# Altium schematic sheet LCD_RGB.SchDoc
size A3
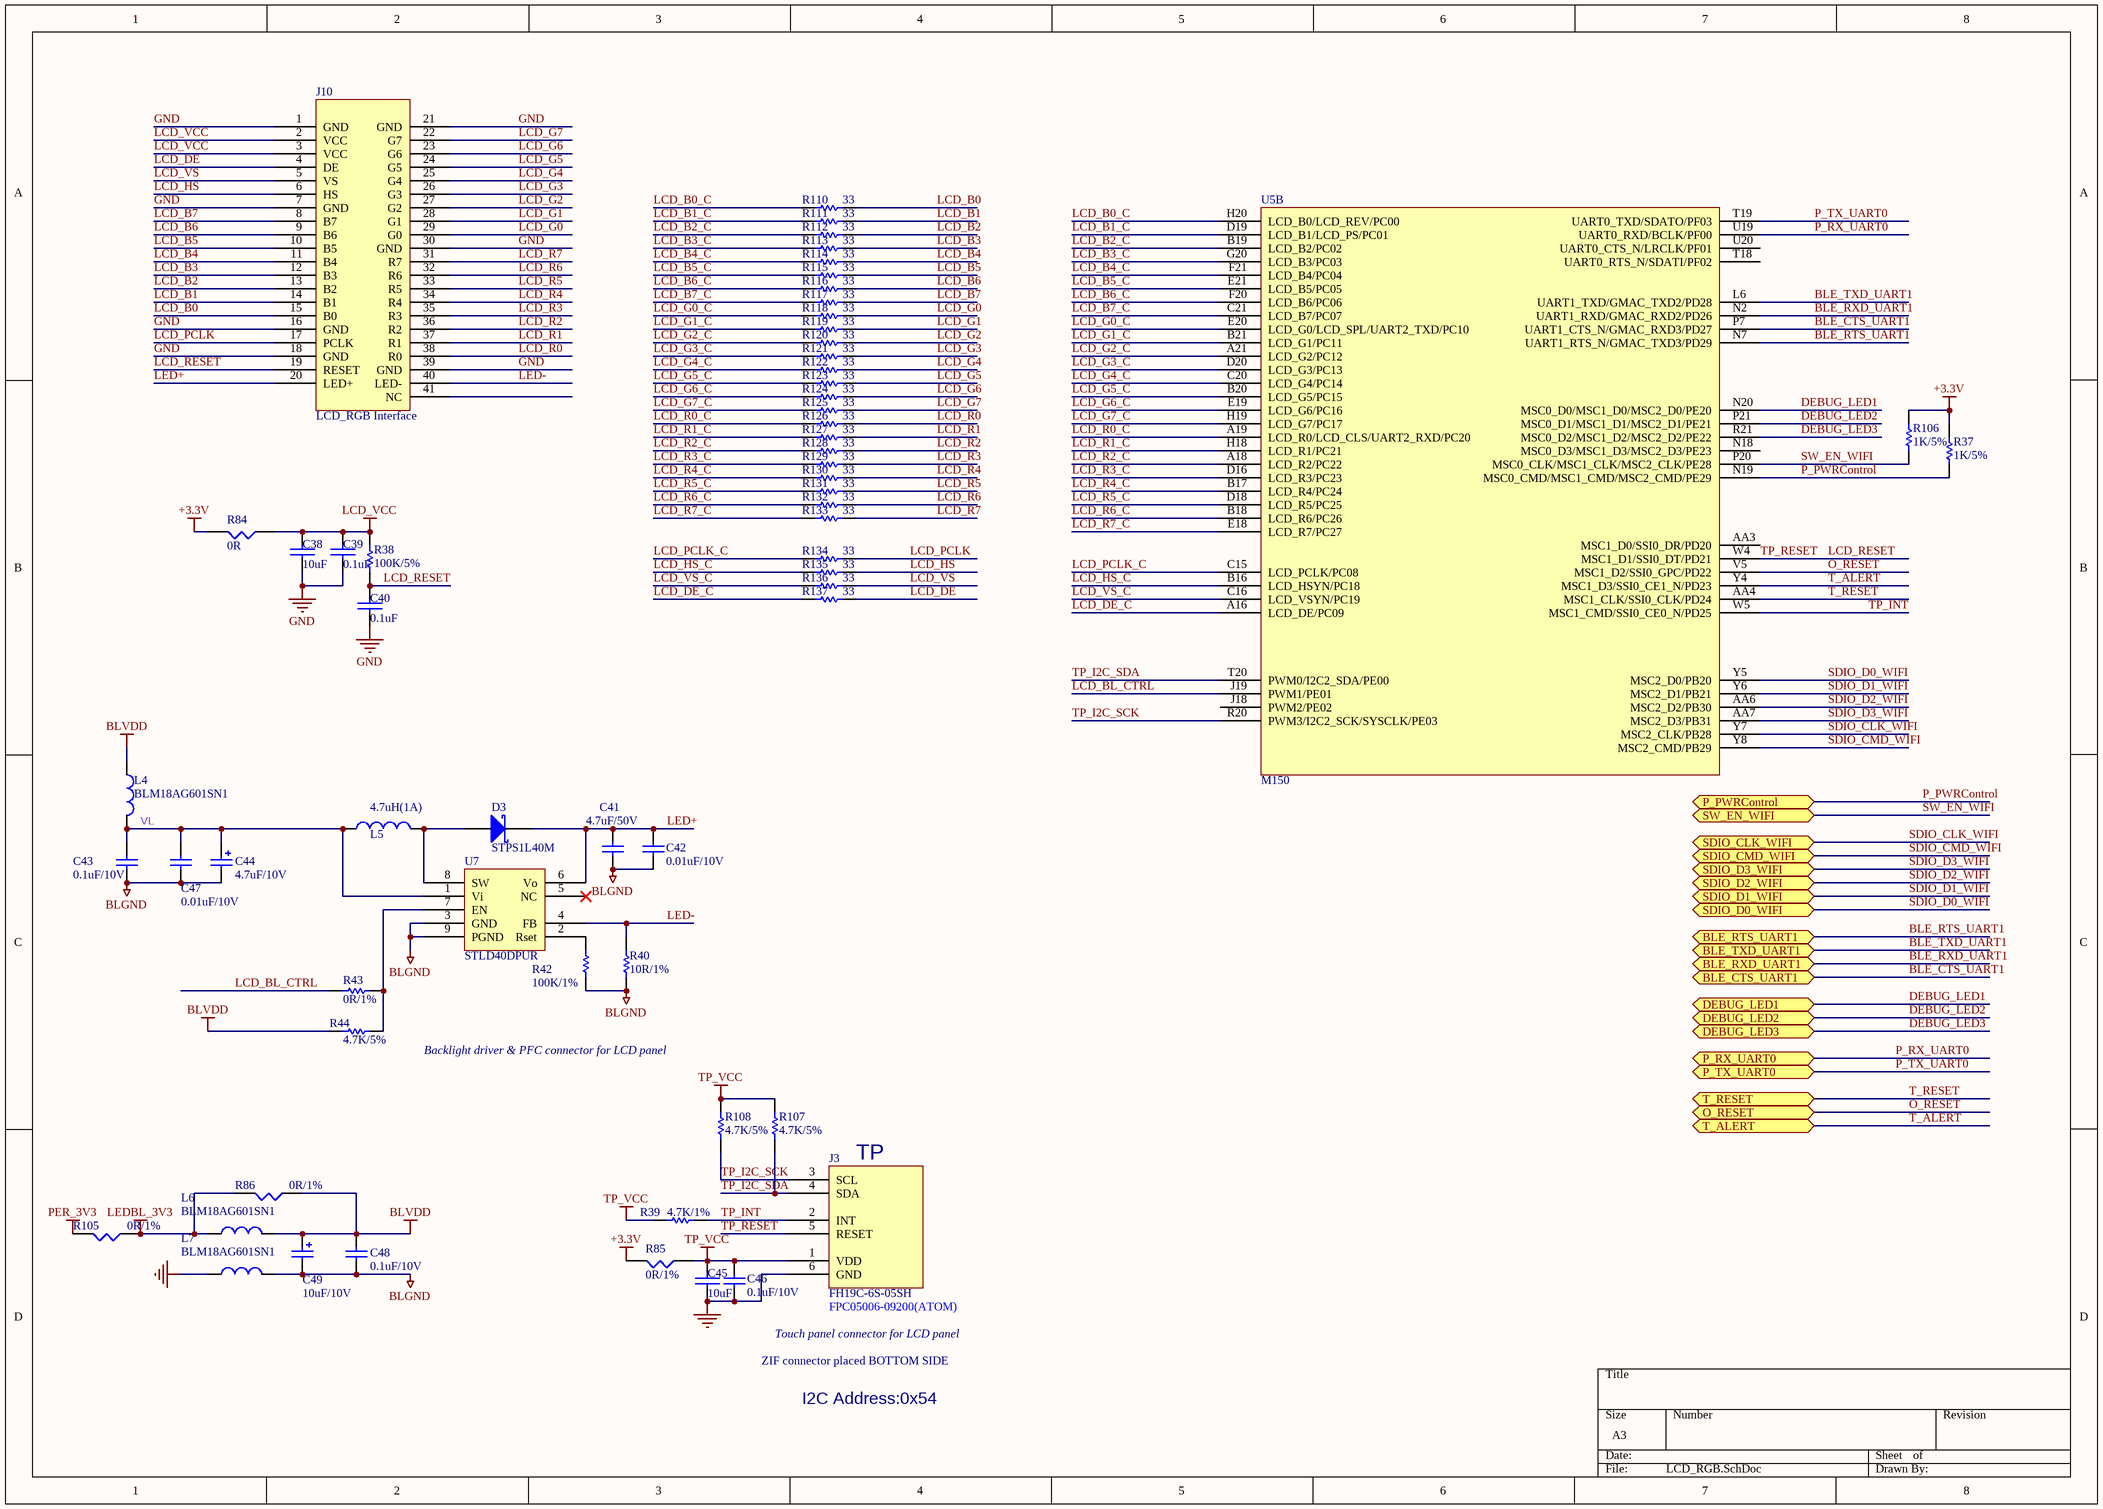
[diagram p0: LCD_RGB.SchDoc]

## Parts
C38  10uF  [0402C]
C39  0.1uF  [0402C]
C40  0.1uF  [0402C]
C41  4.7uF/50V  [0603C]
C42  0.01uF/10V  [0402C]
C43  0.1uF/10V  [0402C]
C44  4.7uF/10V  [1206]
C45  10uF  [0402C]
C46  0.1uF/10V  [0402C]
C47  0.01uF/10V  [0402C]
C48  0.1uF/10V  [0402C]
C49  10uF/10V  [TAN-A]
D3  STPS1L40M  [DO-216AA]
J3  FH19C-6S-05SH  [FH19C-6S-0R5SH_FPC_CPT]
J10  LCD_RGB Interface
L4  BLM18AG601SN1  [0603R]
L5  4.7uH(1A)  [1210L]
L6  BLM18AG601SN1  [0603R]
L7  BLM18AG601SN1  [0603R]
R37  1K/5%  [0402R]
R38  100K/5%  [0402R]
R39  4.7K/1%  [0402R]
R40  10R/1%  [0402R]
R42  100K/1%  [0402R]
R43  0R/1%  [0603R]
R44  4.7K/5%  [0402R]
R84  0R  [0603R]
R85  0R/1%  [0603R]
R86  0R/1%  [0603R]
R105  0R/1%  [0603R]
R106  1K/5%  [0402R]
R107  4.7K/5%  [0402R]
R108  4.7K/5%  [0402R]
R110  33  [0402R]
R111  33  [0402R]
R112  33  [0402R]
R113  33  [0402R]
R114  33  [0402R]
R115  33  [0402R]
R116  33  [0402R]
R117  33  [0402R]
R118  33  [0402R]
R119  33  [0402R]
R120  33  [0402R]
R121  33  [0402R]
R122  33  [0402R]
R123  33  [0402R]
R124  33  [0402R]
R125  33  [0402R]
R126  33  [0402R]
R127  33  [0402R]
R128  33  [0402R]
R129  33  [0402R]
R130  33  [0402R]
R131  33  [0402R]
R132  33  [0402R]
R133  33  [0402R]
R134  33  [0402R]
R135  33  [0402R]
R136  33  [0402R]
R137  33  [0402R]
U5  M150  [Model Name]  (part B of 4)
U7  STLD40DPUR  [SON8_0R65_3X3]

## Ports
BLE_CTS_UART1 (bidir), BLE_RTS_UART1 (bidir), BLE_RXD_UART1 (bidir), BLE_TXD_UART1 (bidir), DEBUG_LED1 (bidir), DEBUG_LED2 (bidir), DEBUG_LED3 (bidir), O_RESET (bidir), P_PWRControl (bidir), P_RX_UART0 (bidir), P_TX_UART0 (bidir), SDIO_CLK_WIFI (bidir), SDIO_CMD_WIFI (bidir), SDIO_D0_WIFI (bidir), SDIO_D1_WIFI (bidir), SDIO_D2_WIFI (bidir), SDIO_D3_WIFI (bidir), SW_EN_WIFI (bidir), T_ALERT (bidir), T_RESET (bidir)

## Nets
+3.3V: R37.1 R84.2 R85.2 R106.1
BLGND: C41.2 C42.1 C43.1 C44.2 C47.1 C48.2 C49.2 L7.2 R40.1 R42.2 U7.3(GND) U7.9(PGND)
BLVDD: C48.1 C49.1 L4.1 L6.2 R44.2 R86.1
GND: C38.1 C39.1 C40.1 C45.1 C46.1 J3.6(GND) J10.1(GND) J10.7(GND) J10.16(GND) J10.18(GND) J10.21(GND) J10.30(GND) J10.39(GND) L7.1
LCD_VCC: C38.2 C39.2 J10.2(VCC) J10.3(VCC) R38.1 R84.1
LEDBL_3V3: L6.1 R86.2 R105.1
PER_3V3: R105.2
TP_VCC: C45.2 C46.2 J3.1(VDD) R39.1 R85.1 R107.2 R108.2
BLE_CTS_UART1: U5.P7(UART1_CTS_N/GMAC_RXD3/PD27) ; port BLE_CTS_UART1
BLE_RTS_UART1: U5.N7(UART1_RTS_N/GMAC_TXD3/PD29) ; port BLE_RTS_UART1
BLE_RXD_UART1: U5.N2(UART1_RXD/GMAC_RXD2/PD26) ; port BLE_RXD_UART1
BLE_TXD_UART1: U5.L6(UART1_TXD/GMAC_TXD2/PD28) ; port BLE_TXD_UART1
DEBUG_LED1: U5.N20(MSC0_D0/MSC1_D0/MSC2_D0/PE20) ; port DEBUG_LED1
DEBUG_LED2: U5.P21(MSC0_D1/MSC1_D1/MSC2_D1/PE21) ; port DEBUG_LED2
DEBUG_LED3: U5.R21(MSC0_D2/MSC1_D2/MSC2_D2/PE22) ; port DEBUG_LED3
LCD_B0: J10.15(B0) R110.2
LCD_B0_C: R110.1 U5.H20(LCD_B0/LCD_REV/PC00)
LCD_B1: J10.14(B1) R111.2
LCD_B1_C: R111.1 U5.D19(LCD_B1/LCD_PS/PC01)
LCD_B2: J10.13(B2) R112.2
LCD_B2_C: R112.1 U5.B19(LCD_B2/PC02)
LCD_B3: J10.12(B3) R113.2
LCD_B3_C: R113.1 U5.G20(LCD_B3/PC03)
LCD_B4: J10.11(B4) R114.2
LCD_B4_C: R114.1 U5.F21(LCD_B4/PC04)
LCD_B5: J10.10(B5) R115.2
LCD_B5_C: R115.1 U5.E21(LCD_B5/PC05)
LCD_B6: J10.9(B6) R116.2
LCD_B6_C: R116.1 U5.F20(LCD_B6/PC06)
LCD_B7: J10.8(B7) R117.2
LCD_B7_C: R117.1 U5.C21(LCD_B7/PC07)
LCD_BL_CTRL: R43.2 U5.J19(PWM1/PE01)
LCD_DE: J10.4(DE) R137.2
LCD_DE_C: R137.1 U5.A16(LCD_DE/PC09)
LCD_G0: J10.29(G0) R118.2
LCD_G0_C: R118.1 U5.E20(LCD_G0/LCD_SPL/UART2_TXD/PC10)
LCD_G1: J10.28(G1) R119.2
LCD_G1_C: R119.1 U5.B21(LCD_G1/PC11)
LCD_G2: J10.27(G2) R120.2
LCD_G2_C: R120.1 U5.A21(LCD_G2/PC12)
LCD_G3: J10.26(G3) R121.2
LCD_G3_C: R121.1 U5.D20(LCD_G3/PC13)
LCD_G4: J10.25(G4) R122.2
LCD_G4_C: R122.1 U5.C20(LCD_G4/PC14)
LCD_G5: J10.24(G5) R123.2
LCD_G5_C: R123.1 U5.B20(LCD_G5/PC15)
LCD_G6: J10.23(G6) R124.2
LCD_G6_C: R124.1 U5.E19(LCD_G6/PC16)
LCD_G7: J10.22(G7) R125.2
LCD_G7_C: R125.1 U5.H19(LCD_G7/PC17)
LCD_HS: J10.6(HS) R135.2
LCD_HS_C: R135.1 U5.B16(LCD_HSYN/PC18)
LCD_PCLK: J10.17(PCLK) R134.2
LCD_PCLK_C: R134.1 U5.C15(LCD_PCLK/PC08)
LCD_R0: J10.38(R0) R126.2
LCD_R0_C: R126.1 U5.A19(LCD_R0/LCD_CLS/UART2_RXD/PC20)
LCD_R1: J10.37(R1) R127.2
LCD_R1_C: R127.1 U5.H18(LCD_R1/PC21)
LCD_R2: J10.36(R2) R128.2
LCD_R2_C: R128.1 U5.A18(LCD_R2/PC22)
LCD_R3: J10.35(R3) R129.2
LCD_R3_C: R129.1 U5.D16(LCD_R3/PC23)
LCD_R4: J10.34(R4) R130.2
LCD_R4_C: R130.1 U5.B17(LCD_R4/PC24)
LCD_R5: J10.33(R5) R131.2
LCD_R5_C: R131.1 U5.D18(LCD_R5/PC25)
LCD_R6: J10.32(R6) R132.2
LCD_R6_C: R132.1 U5.B18(LCD_R6/PC26)
LCD_R7: J10.31(R7) R133.2
LCD_R7_C: R133.1 U5.E18(LCD_R7/PC27)
LCD_RESET: C40.2 J3.5(RESET) J10.19(RESET) R38.2 U5.W4(MSC1_D1/SSI0_DT/PD21)  [also labelled TP_RESET]
LCD_VS: J10.5(VS) R136.2
LCD_VS_C: R136.1 U5.C16(LCD_VSYN/PC19)
LED+: C41.1 C42.2 D3.2(K) J10.20(LED+) U7.6(Vo)
LED-: J10.40(LED-) R40.2 U7.4(FB)
O_RESET: U5.V5(MSC1_D2/SSI0_GPC/PD22) ; port O_RESET
P_PWRControl: R37.2 U5.N19(MSC0_CMD/MSC1_CMD/MSC2_CMD/PE29) ; port P_PWRControl
P_RX_UART0: U5.U19(UART0_RXD/BCLK/PF00) ; port P_RX_UART0
P_TX_UART0: U5.T19(UART0_TXD/SDATO/PF03) ; port P_TX_UART0
SDIO_CLK_WIFI: U5.Y7(MSC2_CLK/PB28) ; port SDIO_CLK_WIFI
SDIO_CMD_WIFI: U5.Y8(MSC2_CMD/PB29) ; port SDIO_CMD_WIFI
SDIO_D0_WIFI: U5.Y5(MSC2_D0/PB20) ; port SDIO_D0_WIFI
SDIO_D1_WIFI: U5.Y6(MSC2_D1/PB21) ; port SDIO_D1_WIFI
SDIO_D2_WIFI: U5.AA6(MSC2_D2/PB30) ; port SDIO_D2_WIFI
SDIO_D3_WIFI: U5.AA7(MSC2_D3/PB31) ; port SDIO_D3_WIFI
SW_EN_WIFI: R106.2 U5.P20(MSC0_CLK/MSC1_CLK/MSC2_CLK/PE28) ; port SW_EN_WIFI
T_ALERT: U5.Y4(MSC1_D3/SSI0_CE1_N/PD23) ; port T_ALERT
T_RESET: U5.AA4(MSC1_CLK/SSI0_CLK/PD24) ; port T_RESET
TP_I2C_SCK: J3.3(SCL) R108.1 U5.R20(PWM3/I2C2_SCK/SYSCLK/PE03)
TP_I2C_SDA: J3.4(SDA) R107.1 U5.T20(PWM0/I2C2_SDA/PE00)
TP_INT: J3.2(INT) R39.2 U5.W5(MSC1_CMD/SSI0_CE0_N/PD25)
VL: C43.2 C44.1 C47.2 L4.2 L5.1 U7.1(Vi)
NetD3_1: D3.1(A) L5.2 U7.8(SW)
NetR42_1: R42.1 U7.2(Rset)
NetR43_1: R43.1 R44.1 U7.7(EN)

Not connected (* = marked no-connect by the designer): J10 41(NC); U5 AA3(MSC1_D0/SSI0_DR/PD20) J18(PWM2/PE02) N18(MSC0_D3/MSC1_D3/MSC2_D3/PE23) T18(UART0_RTS_N/SDATI/PF02) U20(UART0_CTS_N/LRCLK/PF01); U7 5(NC)*

## Notes on the sheet
- Backlight driver & PFC connector for LCD panel
- (near J3) TP
- (near J3) FPC05006-09200(ATOM)
- ZIF connector placed BOTTOM SIDE
- Touch panel connector for LCD panel
- I2C Address:0x54

## Library data of the parts
C38-C40 C45 = CAP: 厂家：Murata，型号：GRM1555C1H120JA01D
C41 C42 C47 = CAP: 厂家：Murata，型号：; Value: 100pF; Ordered by: Subcon; Published: 8-Jun-2000; Revision: July-2002: Re-released for DXP Platform.; Publisher: Altium Limited
C43 C46 = CAP: Capacitor; Value: 100pF; Ordered by: Subcon; Published: 8-Jun-2000; Revision: July-2002: Re-released for DXP Platform.; Publisher: Altium Limited
C44 = Cap Pol1: Value: 100pF; Ordered by: Subcon; Published: 8-Jun-2000; Revision: July-2002: Re-released for DXP Platform.; Publisher: Altium Limited
C48 = Cap: Capacitor; Value: 10nF; Ordered by: Subcon; Published: 8-Jun-2000; Revision: July-2002: Re-released for DXP Platform.; Publisher: Altium Limited
C49 = Cap Pol1: Polarized Capacitor (Radial); Value: 10uF; Ordered by: Subcon; Published: 8-Jun-2000; Revision: July-2002: Re-released for DXP Platform.; Publisher: Altium Limited
D3 = D Schottky: Schottky Diode; Code - JEDEC: DO-214-AA; Ordered by: ST; Ref St: 9151085; ECCN_US/EU: EAR99/NEC; Published: 8-Jun-2000; Revision: July-2002: Re-released for DXP Platform.; Publisher: Altium Limited; Manuf_1: ST; Manuf_Part_1: STPS1L40M
J3 = FH19C-6S-05SH: ZIF connector placed bottom side; Manuf_1: ATOM; Manuf_2: Hirose; Manuf_Part_1: FPC05006-09200; Ordered by: Subcon; Silkscreen: TS; Manuf_Part_2: FH19C-6S-05SH
L4 L6 L7 = CHOKE: 厂家：MURATA，型号：BLM18AG601SN1
L5 = Inductor: Value: 100uH; Ordered by: Subcon; Published: 8-Jun-2000; Revision: July-2002: Re-released for DXP Platform.; Publisher: Altium Limited
R37 R38 R40 R42 R106 R110-R137 = Res1: Resistor; Value: 1K; Ordered by: Subcon; Published: 8-Jun-2000; Revision: July-2002: Re-released for DXP Platform.; Publisher: Altium Limited
R39 R44 R107 R108 = Res1: 厂家：Yageo，型号：; Value: 1K; Ordered by: Subcon; Published: 8-Jun-2000; Revision: July-2002: Re-released for DXP Platform.; Publisher: Altium Limited
R43 = Res1: Resistor; Value: 1K; Ordered by: Subcon; Fitted: NO; Published: 8-Jun-2000; Revision: July-2002: Re-released for DXP Platform.; Publisher: Altium Limited
R84-R86 R105 = RES1: 厂家：Yageo，型号：RC0402FR-070RL
U7 = STLD40DPMR: Ordered by: ST; Ref St: 9176009; ECCN_US/EU: EAR99/NEC; Manuf_1: ST; Manuf_Part_1: STLD40DPUR